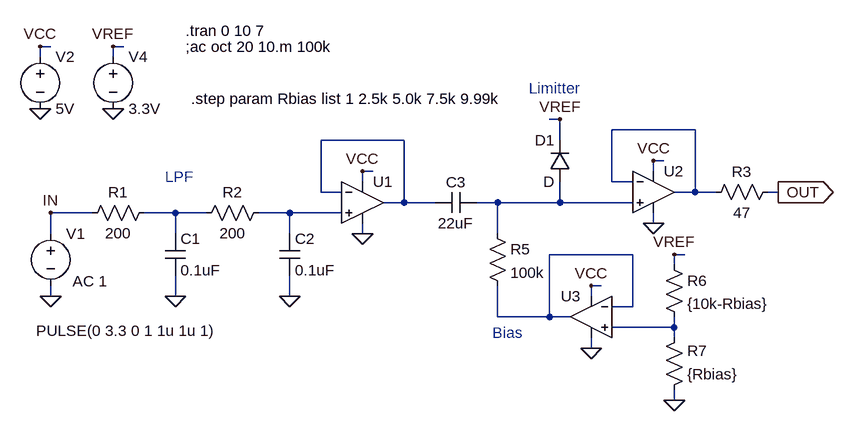
[diagram p0: schematic ArduinoLFO_Ouput_Board.asc]
ArduinoLFO_Ouput_Board.asc, the LTspice schematic file:
Version 4
SHEET 1 1556 680
WIRE 208 -160 192 -160
WIRE 320 -160 304 -160
WIRE 192 -144 192 -160
WIRE 304 -144 304 -160
WIRE 992 -48 976 -48
WIRE 1200 -32 1072 -32
WIRE 752 -16 624 -16
WIRE 992 -16 992 -48
WIRE 1152 16 1136 16
WIRE 704 32 688 32
WIRE 1136 32 1136 16
WIRE 688 48 688 32
WIRE 1072 48 1072 -32
WIRE 1104 48 1072 48
WIRE 624 64 624 -16
WIRE 656 64 624 64
WIRE 1200 64 1200 -32
WIRE 1200 64 1168 64
WIRE 1232 64 1200 64
WIRE 1328 64 1312 64
WIRE 752 80 752 -16
WIRE 752 80 720 80
WIRE 800 80 752 80
WIRE 896 80 864 80
WIRE 992 80 992 48
WIRE 992 80 896 80
WIRE 1104 80 992 80
WIRE 272 96 208 96
WIRE 400 96 352 96
WIRE 448 96 400 96
WIRE 576 96 528 96
WIRE 656 96 576 96
WIRE 1136 112 1136 96
WIRE 208 128 208 96
WIRE 400 128 400 96
WIRE 576 128 576 96
WIRE 688 128 688 112
WIRE 896 128 896 80
WIRE 1104 160 976 160
WIRE 1184 160 1168 160
WIRE 1168 176 1168 160
WIRE 1056 208 1040 208
WIRE 208 224 208 208
WIRE 400 224 400 192
WIRE 576 224 576 192
WIRE 1040 224 1040 208
WIRE 1104 240 1104 160
WIRE 1104 240 1072 240
WIRE 896 256 896 208
WIRE 976 256 976 160
WIRE 976 256 896 256
WIRE 1008 256 976 256
WIRE 1168 272 1168 256
WIRE 1168 272 1072 272
WIRE 1168 288 1168 272
WIRE 1040 304 1040 288
WIRE 1168 384 1168 368
FLAG 208 224 0
FLAG 208 96 IN
FLAG 400 224 0
FLAG 1328 64 OUT
IOPIN 1328 64 Out
FLAG 576 224 0
FLAG 688 32 VCC
FLAG 688 128 0
FLAG 192 -64 0
FLAG 192 -160 VCC
FLAG 1136 16 VCC
FLAG 1136 112 0
FLAG 992 -48 VREF
FLAG 304 -64 0
FLAG 304 -160 VREF
FLAG 1040 208 VCC
FLAG 1040 304 0
FLAG 1168 384 0
FLAG 1168 160 VREF
SYMBOL voltage 208 112 R0
WINDOW 3 -22 165 Left 2
WINDOW 123 34 89 Left 2
WINDOW 39 0 0 Left 2
SYMATTR Value PULSE(0 3.3 0 1 1u 1u 1)
SYMATTR Value2 AC 1
SYMATTR InstName V1
SYMBOL cap 384 128 R0
SYMATTR InstName C1
SYMATTR Value 0.1uF
SYMBOL res 368 80 R90
WINDOW 0 0 56 VBottom 2
WINDOW 3 32 56 VTop 2
SYMATTR InstName R1
SYMATTR Value 200
SYMBOL cap 560 128 R0
SYMATTR InstName C2
SYMATTR Value 0.1uF
SYMBOL res 544 80 R90
WINDOW 0 0 56 VBottom 2
WINDOW 3 32 56 VTop 2
SYMATTR InstName R2
SYMATTR Value 200
SYMBOL Opamps\\UniversalOpamp2 688 80 R0
SYMATTR InstName U1
SYMBOL voltage 192 -160 R0
SYMATTR InstName V2
SYMATTR Value 5V
SYMBOL res 880 112 R0
SYMATTR InstName R5
SYMATTR Value 100k
SYMBOL cap 864 64 R90
WINDOW 0 0 32 VBottom 2
WINDOW 3 32 32 VTop 2
SYMATTR InstName C3
SYMATTR Value 22uF
SYMBOL Opamps\\UniversalOpamp2 1136 64 R0
SYMATTR InstName U2
SYMBOL voltage 304 -160 R0
SYMATTR InstName V4
SYMATTR Value 3.3V
SYMBOL Opamps\\UniversalOpamp2 1040 256 M0
SYMATTR InstName U3
SYMBOL res 1152 160 R0
SYMATTR InstName R6
SYMATTR Value {10k-Rbias}
SYMBOL res 1152 384 M180
WINDOW 0 36 76 Left 2
WINDOW 3 36 40 Left 2
SYMATTR InstName R7
SYMATTR Value {Rbias}
SYMBOL diode 1008 48 R180
WINDOW 0 24 64 Left 2
WINDOW 3 24 0 Left 2
SYMATTR InstName D1
SYMBOL res 1328 48 R90
WINDOW 0 0 56 VBottom 2
WINDOW 3 32 56 VTop 2
SYMATTR InstName R3
SYMATTR Value 47
TEXT 416 -184 Left 2 !.tran 0 10 7
TEXT 416 -160 Left 2 !;ac oct 20 10.m 100k
TEXT 424 -80 Left 2 !.step param Rbias list 1 2.5k 5.0k 7.5k 9.99k
TEXT 384 40 Left 2 ;LPF
TEXT 944 -96 Left 2 ;Limitter
TEXT 888 280 Left 2 ;Bias

The netlist it stands for:
* ArduinoLFO_Ouput_Board.asc
V1 IN 0 PULSE(0 3.3 0 1 1u 1u 1) AC 1
C1 N004 0 0.1uF
R1 N004 IN 200
C2 N005 0 0.1uF
R2 N005 N004 200
XU1 N005 N002 VCC 0 N002 level.2 Avol=1Meg GBW=10Meg Slew=10Meg ilimit=25m rail=0 Vos=0 phimargin=45 en=0 enk=0 in=0 ink=0 Rin=500Meg  ; pins IN+ IN- V+ V- OUT
V2 VCC 0 5V
R5 N003 N006 100k
C3 N003 N002 22uF
XU2 N003 N001 VCC 0 N001 level.2 Avol=1Meg GBW=10Meg Slew=10Meg ilimit=25m rail=0 Vos=0 phimargin=45 en=0 enk=0 in=0 ink=0 Rin=500Meg  ; pins IN+ IN- V+ V- OUT
V4 VREF 0 3.3V
XU3 N007 N006 VCC 0 N006 level.2 Avol=1Meg GBW=10Meg Slew=10Meg ilimit=25m rail=0 Vos=0 phimargin=45 en=0 enk=0 in=0 ink=0 Rin=500Meg  ; pins IN+ IN- V+ V- OUT
R6 VREF N007 {10k-Rbias}
R7 0 N007 {Rbias}
D1 N003 VREF D
R3 OUT N001 47
.model D D
.lib standard.dio
.tran 0 10 7
;ac oct 20 10.m 100k
.step param Rbias list 1 2.5k 5.0k 7.5k 9.99k
* LPF
* Limitter
* Bias
.lib UniversalOpamps2.sub
.backanno
.end